# EAGLE design ATX Adapter (EAGLE 6.3)
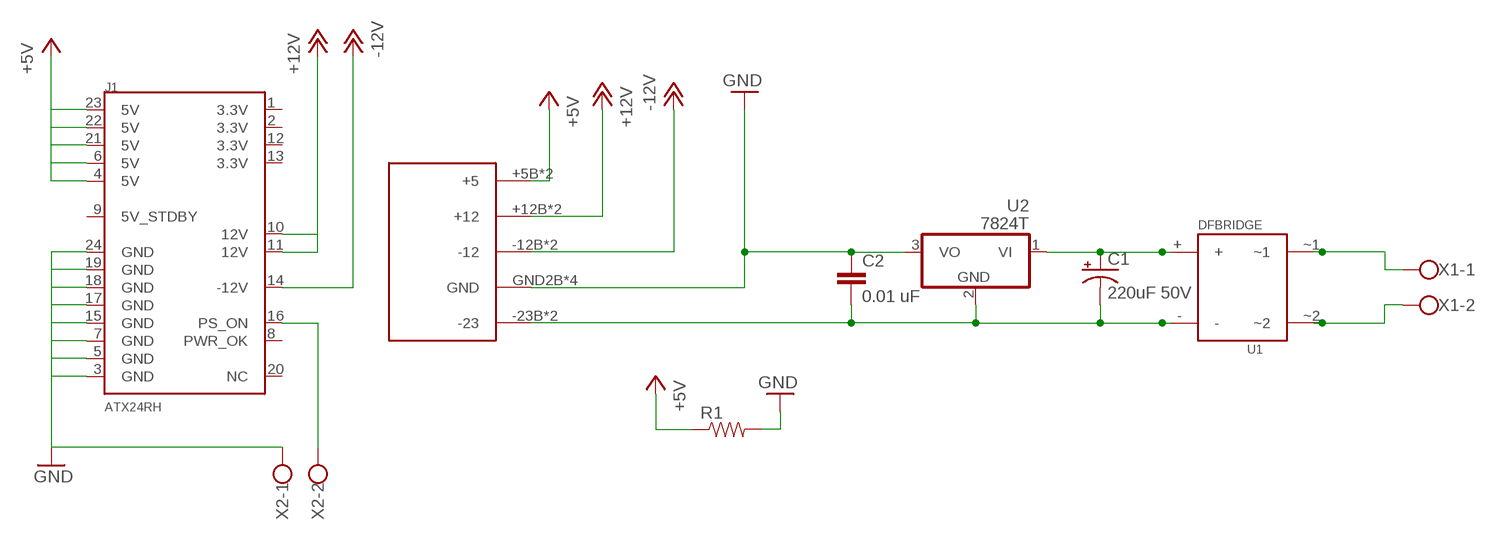
[diagram p0: schematic, sheet 1]

## Parts
C1  220uF 50V  CAP_POLPTH1  [CPOL-RADIAL-100UF-25V]
C2  0.01 uF  CAPEZ  [CAP-PTH-SMALLEZ]
J1  ATX24RH  [ATX24_RIGHT_ANGLE]
R1  RESISTORPTH-2W  [AXIAL-0.8]
U1  DFBRIDGE  [DFBRIDGE]
U2  7824T  [TO220H]
U$1  VT100POWER  [VT100POWER]
X1  W237-102  [W237-102]
X2  W237-102  [W237-102]

## Nets
+5V: J1.4(5V) J1.6(5V) J1.21(5V) J1.22(5V) J1.23(5V) R1.P$1 U$1.+5B(+5) U$1.+5T(+5)
+12V: J1.10(12V) J1.11(12V) U$1.+12B(+12) U$1.+12T(+12)
-12V: J1.14(-12V) U$1.-12B(-12) U$1.-12T(-12)
GND: C2.1 J1.3(GND) J1.5(GND) J1.7(GND) J1.15(GND) J1.17(GND) J1.18(GND) J1.19(GND) J1.24(GND) R1.P$2 U2.3(VO) U$1.GND2B(GND) U$1.GNDB1(GND) U$1.GNDT1(GND) U$1.GNDT2(GND) X2.1
N$5: U1.~1 X1.1
N$6: U1.~2 X1.2
N$7: C1.1(+) U1.+ U2.1(VI)
N$8: C1.2(-) C2.2 U1.- U2.2(GND) U$1.-23B(-23) U$1.-23T(-23)
N$9: J1.16(PS_ON) X2.2
Unconnected: J1.1(3.3V) J1.2(3.3V) J1.8(PWR_OK) J1.9(5V_STDBY) J1.12(3.3V) J1.13(3.3V) J1.20(NC)

## Library data of the parts
C1 = SparkFun-Passives:CAP_POL: Capacitor Polarized These are standard SMD and PTH capacitors. Normally 10uF, 47uF, and 100uF in electrolytic and tantalum varieties. Always verify the external diameter of the through hole cap, it varies with capacity, voltage, and manufacturer. The EIA devices should be standard.
C2 = SparkFun-Passives:CAP: Capacitor Standard 0603 ceramic capacitor, and 0.1" leaded capacitor.
J1 = SparkFun-Connectors:ATX24: ATX24 Pin Power Supply Connector This is a good connector for connecting a computer power supply to a PCB. It's massive, but provides many amps of power at 5V and 12V. SKU: PRT-09498
R1 = SparkFun-Resistors:RESISTOR: Resistor Basic schematic elements and footprints for 0603, 1206, and PTH resistors.
U1 = VT100:DFBRIDGE
U2 = adafruit:78*: Positive VOLTAGE REGULATOR Added bigger pads to the TO-92 package
U$1 = VT100:VT100POWER: VT100 Power Supply Card Edge Slot
X1 X2 = con-wago-500:W237-102: WAGO SCREW CLAMP; MPN: 237-102; OC_FARNELL: unknown; OC_NEWARK: 70K9898

## Board
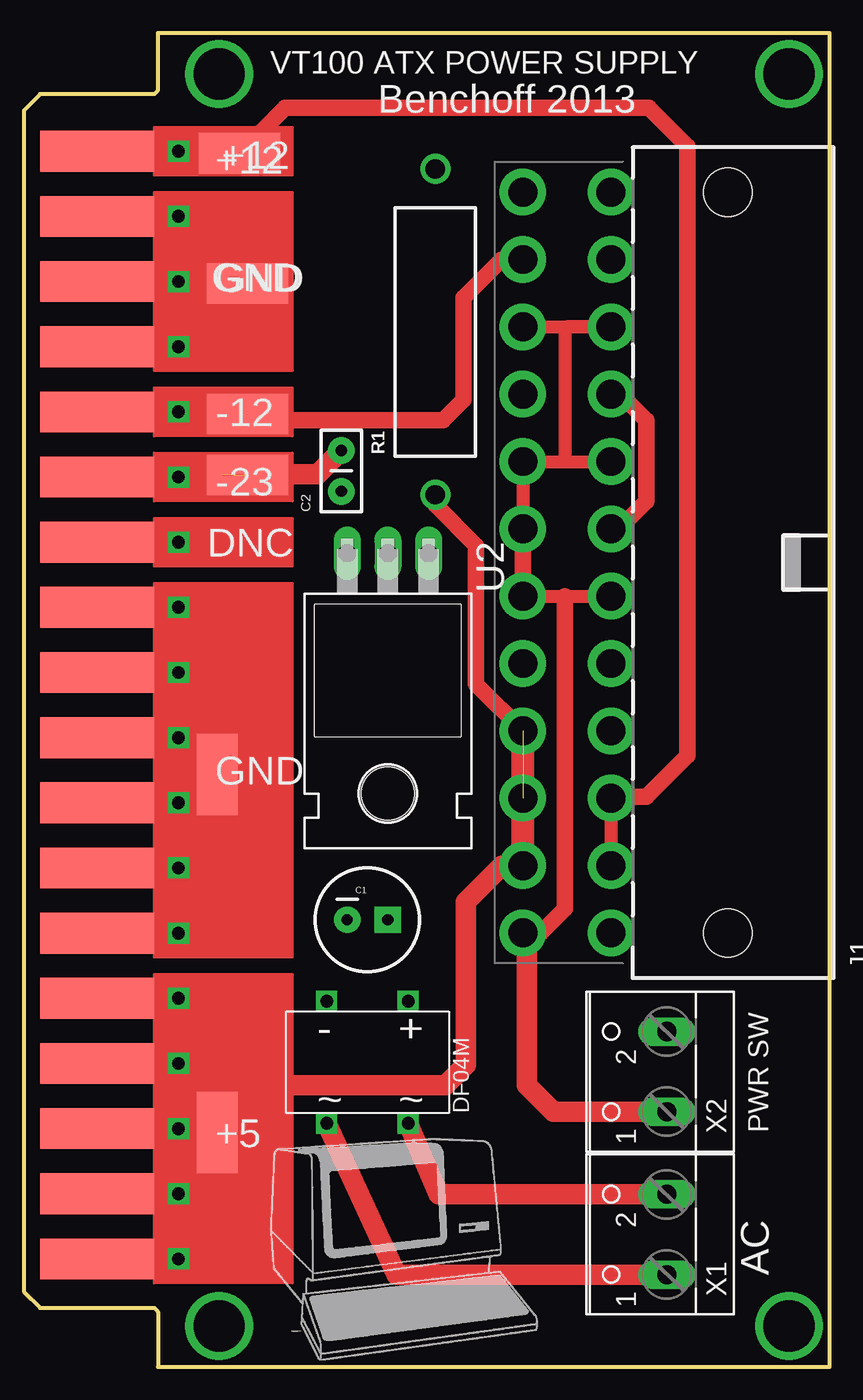
[diagram p1: board, top side]
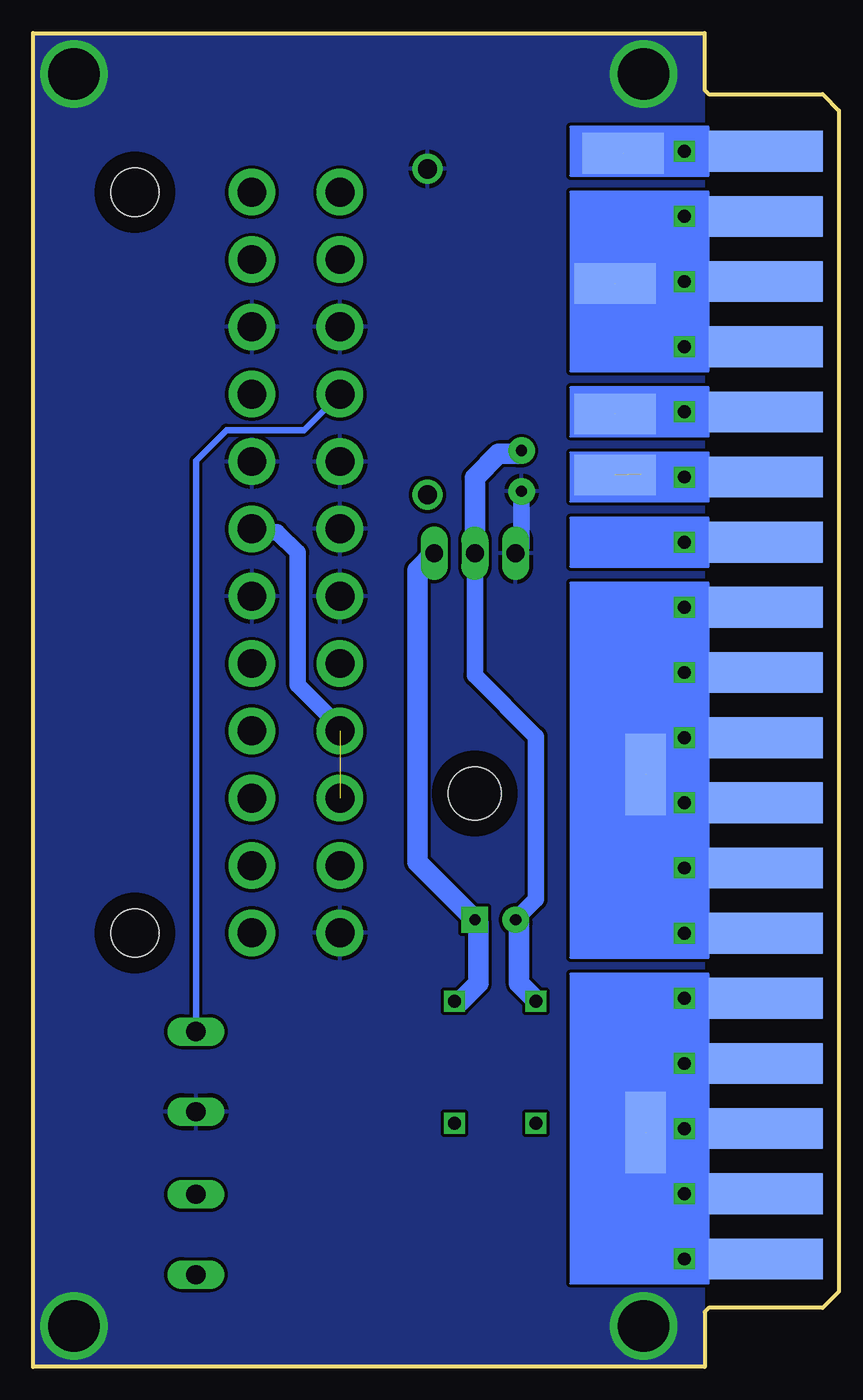
[diagram p2: board, bottom side, seen from below]

No outline drawn. Coordinates in mm, seen from the top.
Copper layers (1*16): Top 0.035mm / dielectric 1.5mm / Bottom 0.035mm
Design rules "default": minimum track width 10mil, minimum drill 24mil, track to track 8mil, track to pad 8mil, pad to pad 8mil, via to via 8mil, smd to smd 8mil, copper to edge 40mil, drill to drill 8mil, minimum pad ring 10mil, minimum via ring 8mil, stop-mask expansion 4mil, vias tented up to drill 0mil, thermal gap 10mil
Milling: 12 lines

### Footprints (pad centres in the part's own frame; a part is rotated, then mirrored left to right if it is on the bottom)
CPOL-RADIAL-100UF-25V = drill 0.7 pad 1.651 square: 1 1.27,0 | drill 0.7 pad 1.651: 2 -1.27,0
CAP-PTH-SMALLEZ = drill 0.7 pad 1.651: 1 0,0; 2 2.54,0
ATX24_RIGHT_ANGLE = drill 1.8 pad 2.9: 1 23.1,4.76; 2 18.9,4.76; 3 14.7,4.76; 4 10.5,4.76; 5 6.3,4.76; 6 2.1,4.76; 7 -2.1,4.76; 8 -6.3,4.76; 9 -10.5,4.76; 10 -14.7,4.76; 11 -18.9,4.76; 12 -23.1,4.76; 13 23.1,10.26; 14 18.9,10.26; 15 14.7,10.26; 16 10.5,10.26; 17 6.3,10.26; 18 2.1,10.26; 19 -2.1,10.26; 20 -6.3,10.26; 21 -10.5,10.26; 22 -14.7,10.26; 23 -18.9,10.26; 24 -23.1,10.26 | hole 3: -23.1,-2.54; 23.1,-2.54
AXIAL-0.8 = drill 1.2 pad 1.88: P$1 -10.16,0; P$2 10.16,0
DFBRIDGE = drill 0.8 square: + 2.54,3.81; - -2.54,3.81; ~1 -2.54,-3.81; ~2 2.54,-3.81
TO220H = drill 1.118 long: 1 -2.54,-10.16; 2 0,-10.16; 3 2.54,-10.16 | hole 3.302: 0,4.826
VT100POWER = smd 2.54 x 5.08 bottom: +5B 2.413,-26.67; GND2B 2.413,-4.318 | smd 2.54 x 5.08: +5T 2.413,-26.67; GNDT2 2.413,-4.318 | smd 5.08 x 2.54 bottom: +12B 3.81,34.417; -12B 4.318,18.161; -23B 4.318,14.351; GNDB1 4.318,26.289; P$124 -6.096,-34.544; P$125 -6.096,-30.48; P$126 -6.096,-26.416; P$127 -6.096,-22.352; P$128 -6.096,-18.288; P$129 -6.096,-14.224; P$130 -6.096,-10.16; P$131 -6.096,-6.096; P$132 -6.096,-2.032; P$133 -6.096,2.032; P$134 -6.096,6.096; P$135 -6.096,10.16; P$136 -6.096,14.224; P$137 -6.096,18.288; P$138 -6.096,22.352; P$139 -6.096,26.416; P$140 -6.096,30.48; P$141 -6.096,34.544; P$142 -4.064,34.544; P$143 -4.064,30.48; P$144 -4.064,26.416; P$145 -4.064,22.352; P$146 -4.064,18.288; P$147 -4.064,14.224; P$148 -4.064,10.16; P$149 -4.064,6.096; P$150 -4.064,2.032; P$151 -4.064,-2.032; P$152 -4.064,-6.096; P$153 -4.064,-10.16; P$154 -4.064,-14.224; P$155 -4.064,-18.288; P$156 -4.064,-22.352; P$157 -4.064,-26.416; P$158 -4.064,-30.48; P$159 -4.064,-34.544 | smd 5.08 x 2.54: +12T 3.81,34.417; -12T 4.318,18.161; -23T 4.318,14.351; GNDT1 4.318,26.289; P$18 -6.096,2.032; P$89 -6.096,-2.032; P$90 -6.096,-6.096; P$91 -6.096,-10.16; P$92 -6.096,-14.224; P$93 -6.096,34.544; P$94 -6.096,30.48; P$95 -6.096,26.416; P$96 -6.096,22.352; P$97 -6.096,18.288; P$98 -6.096,14.224; P$99 -6.096,10.16; P$100 -6.096,6.096; P$101 -6.096,-18.288; P$102 -6.096,-22.352; P$103 -6.096,-26.416; P$104 -6.096,-30.48; P$105 -6.096,-34.544; P$106 -4.064,34.544; P$107 -4.064,30.48; P$108 -4.064,26.416; P$109 -4.064,22.352; P$110 -4.064,18.288; P$111 -4.064,14.224; P$112 -4.064,10.16; P$113 -4.064,6.096; P$114 -4.064,2.032; P$115 -4.064,-2.032; P$116 -4.064,-6.096; P$117 -4.064,-10.16; P$118 -4.064,-14.224; P$119 -4.064,-18.288; P$120 -4.064,-22.352; P$121 -4.064,-26.416; P$122 -4.064,-30.48; P$123 -4.064,-34.544 | drill 0.8 square: P$1 0,-34.544; P$2 0,-30.48; P$3 0,-26.416; P$4 0,-22.352; P$5 0,-18.288; P$6 0,-14.224; P$7 0,-10.16; P$8 0,-6.096; P$9 0,-2.032; P$10 0,2.032; P$11 0,6.096; P$12 0,10.16; P$13 0,14.224; P$14 0,18.288; P$15 0,22.352; P$16 0,26.416; P$17 0,30.48; P$19 0,34.544
W237-102 = drill 1.194 long: 1 -2.5,-1.27; 2 2.5,-1.27

### Placement (x,y rotation side)
C1  21.8,28.1 0 top
C2  20.16,54.82 90 top
J1  41.75,50.38 90 top
R1  26.04,64.77 90 top
U1  21.8,19.21 0 top
U2  23.07,40.8 180 top
U$1  10,41.49 0 top
X1  39.21,8.47 90 top
X2  39.21,18.63 90 top

### Tracks (layer width: path | path; a pad name or v marks a point on that pad's centre or on a via)
+5V  (2 unrouted)
  Top 1.016: J1.6 37.5,52.48 39.21,54.19 39.21,59.27 37.94,60.54 37.33,60.54 J1.4 | R1.P$1 26.04,53.98 28.57,51.44 28.57,42.79 J1.21
  Top 1.27: J1.23 30.21,31.48 27.94,29.21 27.94,19.05 26.67,17.78 15.38,17.78 U$1.+5B
  Top 1.422: J1.23 J1.21
  Bottom 1.016: J1.21 31.49,40.12 34.13,42.76 34.13,51.01 35.4,52.28 36.8,52.28 J1.6
+12V  (1 unrouted)
  Top 0.813: J1.10 J1.11
  Top 1.016: J1.10 37.09,35.77 39.21,35.77 41.75,38.31 41.75,76.36 39.37,78.74 16.65,78.74 U$1.+12T
-12V  (1 unrouted)
  Top 1.016: J1.14 30.17,69.28 27.78,66.89 27.78,60.54 26.51,59.27 14.7,59.27 U$1.-12T
GND  (via drill 3.2)  (2 unrouted)
  Top 0.813: J1.7 34.13,48.28 J1.19 J1.18 J1.17 34.13,56.68 | 34.13,56.68 J1.5 | J1.15 J1.3 34.23,65.08 34.13,64.98 34.13,56.68
  Top 1.016: J1.24 32.62,27.28 34.13,28.79 34.13,48.28 | J1.18 31.49,48 | 12.54,46.99 12.54,37.3 U$1.GND2B
  Top 1.27: X2.1 33.4,16.13 31.75,17.78 31.75,27.02 J1.24
  Bottom 1.016: C2.1 20.16,51.33 U2.3
  other vias: 12.54,80.86 12.54,2.75 48.1,2.75 48.1,80.86
  pour Bottom: 8.73,83.4 8.73,0.21 50.64,0.21 50.64,83.4
N$5
  Top 1.27: X1.1 23.61,5.97 U1.~1
N$6
  Top 1.27: X1.2 26.23,10.97 U1.~2
N$7
  Bottom 1.27: U1.+ 23.97,23.02 22.86,24.13 22.86,27.89 C1.1 26.67,31.7 26.67,49.9 U2.1
N$8  (2 unrouted)
  Top 1.27: C2.2 18.68,55.88 12.7,55.88
  Bottom 1.016: U2.2 23.07,43.34 19.26,39.53 19.26,29.37 C1.2
  Bottom 1.27: U1.- 19.26,23.07 20.32,24.13 20.32,27.89 C1.2 | C2.2 20.37,57.15 21.59,57.15 23.07,55.67 U2.2
N$9
  Bottom 0.406: X2.2 40.48,56.73 38.58,58.63 33.74,58.63 J1.16

### Text on the board
tPlace: VT100 ATX POWER SUPPLY | Benchoff 2013 | +12 | GND | PWR SW | AC